# Altium schematic sheet BK1096_Connector.SchDoc: =project_title
size Tabloid; CompanyName: Luxonis Holding; Organization: Luxonis Holding; Address1: 1925 Harmony Park Drive; Address2: Westminster, CO; Address3: 80234; Address4: United States; SheetNumber: 2; SheetTotal: 5
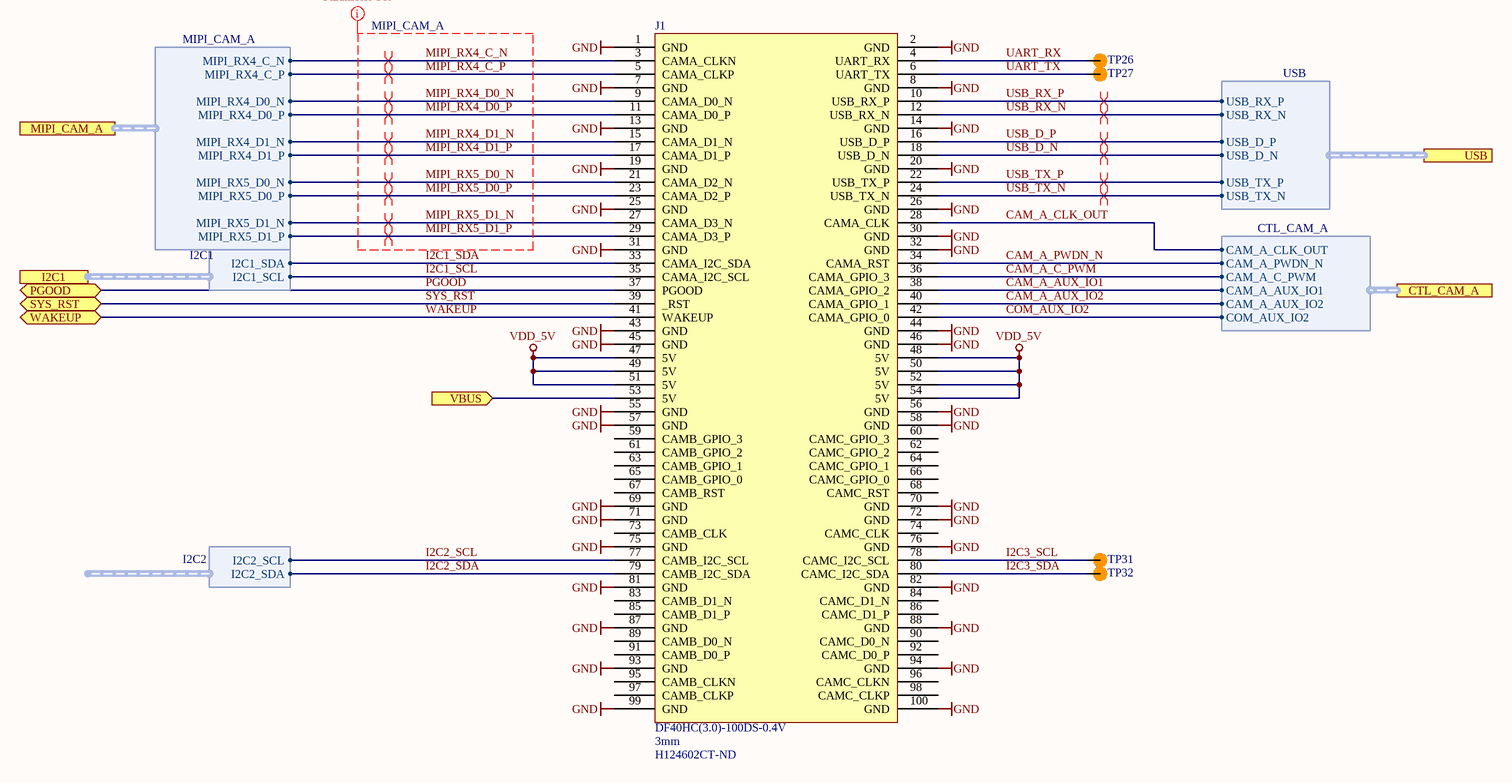
[diagram p0: BK1096_Connector.SchDoc]

## Parts
J1  DF40HC(3.0)-100DS-0.4V  Mated Stacking Heights: 3mm  Supplier Part Number 1: H124602CT-ND  [DF40HC-3.0-100DS-0.4V]
TP26  TP_SMD  [TP_0.75MM_SMD_NO-SILK]  (value not drawn)  (no BOM)
TP27  TP_SMD  [TP_0.75MM_SMD_NO-SILK]  (value not drawn)  (no BOM)
TP31  TP_SMD  [TP_0.75MM_SMD_NO-SILK]  (value not drawn)  (no BOM)
TP32  TP_SMD  [TP_0.75MM_SMD_NO-SILK]  (value not drawn)  (no BOM)

## Ports
CTL_CAM_A (harness CTL_CAM_A), I2C1 (harness I2C1), MIPI_CAM_A (harness MIPI_CAM_A), PGOOD (bidir), SYS_RST (bidir), USB (harness USB), VBUS (in), WAKEUP (bidir)

## Harnesses
MIPI_CAM_A: MIPI_RX4_C_P, MIPI_RX4_C_N, MIPI_RX4_D0_P, MIPI_RX4_D0_N, MIPI_RX4_D1_P, MIPI_RX4_D1_N, MIPI_RX5_D0_P, MIPI_RX5_D0_N, MIPI_RX5_D1_P, MIPI_RX5_D1_N
I2C2: I2C2_SDA, I2C2_SCL
I2C1: I2C1_SDA, I2C1_SCL
USB: USB_D_P, USB_D_N, USB_TX_N, USB_TX_P, USB_RX_N, USB_RX_P
CTL_CAM_A: CAM_A_C_PWM, CAM_A_AUX_IO1, CAM_A_AUX_IO2, COM_AUX_IO2, CAM_A_PWDN_N, CAM_A_CLK_OUT

## Nets
GND: J1.1(GND) J1.2(GND) J1.7(GND) J1.8(GND) J1.13(GND) J1.14(GND) J1.19(GND) J1.20(GND) J1.25(GND) J1.26(GND) J1.30(GND) J1.31(GND) J1.32(GND) J1.43(GND) J1.44(GND) J1.45(GND) J1.46(GND) J1.55(GND) J1.56(GND) J1.57(GND) J1.58(GND) J1.69(GND) J1.70(GND) J1.71(GND) J1.72(GND) J1.75(GND) J1.76(GND) J1.81(GND) J1.82(GND) J1.87(GND) J1.88(GND) J1.93(GND) J1.94(GND) J1.99(GND) J1.100(GND)
VDD_5V: J1.47(5V) J1.48(5V) J1.49(5V) J1.50(5V) J1.51(5V) J1.52(5V) J1.54(5V)
CAM_A_AUX_IO1: J1.38(CAMA_GPIO_2) ; port CTL_CAM_A.CAM_A_AUX_IO1
CAM_A_AUX_IO2: J1.40(CAMA_GPIO_1) ; port CTL_CAM_A.CAM_A_AUX_IO2
CAM_A_C_PWM: J1.36(CAMA_GPIO_3) ; port CTL_CAM_A.CAM_A_C_PWM
CAM_A_CLK_OUT: J1.28(CAMA_CLK) ; port CTL_CAM_A.CAM_A_CLK_OUT
CAM_A_PWDN_N: J1.34(CAMA_RST) ; port CTL_CAM_A.CAM_A_PWDN_N
COM_AUX_IO2: J1.42(CAMA_GPIO_0) ; port CTL_CAM_A.COM_AUX_IO2
I2C1_SCL: J1.35(CAMA_I2C_SCL) ; port I2C1.I2C1_SCL
I2C1_SDA: J1.33(CAMA_I2C_SDA) ; port I2C1.I2C1_SDA
I2C2_SCL: J1.77(CAMB_I2C_SCL) ; harness I2C2.I2C2_SCL
I2C2_SDA: J1.79(CAMB_I2C_SDA) ; harness I2C2.I2C2_SDA
I2C3_SCL: J1.78(CAMC_I2C_SCL) TP31.1
I2C3_SDA: J1.80(CAMC_I2C_SDA) TP32.1
MIPI_RX4_C_N: J1.3(CAMA_CLKN) ; port MIPI_CAM_A.MIPI_RX4_C_N
MIPI_RX4_C_P: J1.5(CAMA_CLKP) ; port MIPI_CAM_A.MIPI_RX4_C_P
MIPI_RX4_D0_N: J1.9(CAMA_D0_N) ; port MIPI_CAM_A.MIPI_RX4_D0_N
MIPI_RX4_D0_P: J1.11(CAMA_D0_P) ; port MIPI_CAM_A.MIPI_RX4_D0_P
MIPI_RX4_D1_N: J1.15(CAMA_D1_N) ; port MIPI_CAM_A.MIPI_RX4_D1_N
MIPI_RX4_D1_P: J1.17(CAMA_D1_P) ; port MIPI_CAM_A.MIPI_RX4_D1_P
MIPI_RX5_D0_N: J1.21(CAMA_D2_N) ; port MIPI_CAM_A.MIPI_RX5_D0_N
MIPI_RX5_D0_P: J1.23(CAMA_D2_P) ; port MIPI_CAM_A.MIPI_RX5_D0_P
MIPI_RX5_D1_N: J1.27(CAMA_D3_N) ; port MIPI_CAM_A.MIPI_RX5_D1_N
MIPI_RX5_D1_P: J1.29(CAMA_D3_P) ; port MIPI_CAM_A.MIPI_RX5_D1_P
PGOOD: J1.37(PGOOD) ; port PGOOD
SYS_RST: J1.39(_RST) ; port SYS_RST
UART_RX: J1.4(UART_RX) TP26.1
UART_TX: J1.6(UART_TX) TP27.1
USB_D_N: J1.18(USB_D_N) ; port USB.USB_D_N
USB_D_P: J1.16(USB_D_P) ; port USB.USB_D_P
USB_RX_N: J1.12(USB_RX_N) ; port USB.USB_RX_N
USB_RX_P: J1.10(USB_RX_P) ; port USB.USB_RX_P
USB_TX_N: J1.24(USB_TX_N) ; port USB.USB_TX_N
USB_TX_P: J1.22(USB_TX_P) ; port USB.USB_TX_P
VBUS: J1.53(5V) ; port VBUS
WAKEUP: J1.41(WAKEUP) ; port WAKEUP

Not connected (* = marked no-connect by the designer): J1 59(CAMB_GPIO_3) 60(CAMC_GPIO_3) 61(CAMB_GPIO_2) 62(CAMC_GPIO_2) 63(CAMB_GPIO_1) 64(CAMC_GPIO_1) 65(CAMB_GPIO_0) 66(CAMC_GPIO_0) 67(CAMB_RST) 68(CAMC_RST) 73(CAMB_CLK) 74(CAMC_CLK) 83(CAMB_D1_N) 84(CAMC_D1_N) 85(CAMB_D1_P) 86(CAMC_D1_P) 89(CAMB_D0_N) 90(CAMC_D0_N) 91(CAMB_D0_P) 92(CAMC_D0_P) 95(CAMB_CLKN) 96(CAMC_CLKN) 97(CAMB_CLKP) 98(CAMC_CLKP)

## Layout directives
differential pair; differential pair class USB_D: USB_D_N, USB_D_P
differential pair; differential pair class USB_RxTX: USB_RX_N, USB_RX_P, USB_TX_N, USB_TX_P
differential pair; differential pair class MIPI_CAMS: MIPI_RX4_C_N, MIPI_RX4_C_P, MIPI_RX4_D0_N, MIPI_RX4_D0_P, MIPI_RX4_D1_N, MIPI_RX4_D1_P, MIPI_RX5_D0_N, MIPI_RX5_D0_P, MIPI_RX5_D1_N, MIPI_RX5_D1_P
net class MIPI_CAM_A; rule Matched Net Lengths [Tolerance = 5mil]: MIPI_RX4_C_N, MIPI_RX4_C_P, MIPI_RX4_D0_N, MIPI_RX4_D0_P, MIPI_RX4_D1_N, MIPI_RX4_D1_P, MIPI_RX5_D0_N, MIPI_RX5_D0_P, MIPI_RX5_D1_N, MIPI_RX5_D1_P

## Notes on the sheet
- Title
- Size:
- Date:
- Tabloid
- Number:
- Time:
- Revision:
- Sheet
- of
- Drawn by:

## Library data of the parts
J1 = DF40HC(3.0)-100DS-0.4V: CONN RCPT 100POS 0.4MM SMD GOLD; Manufacturer 1: Hirose; Manufacturer Part Number 1: DF40HC(3.0)-100DS-0.4V(58; Connector Type: Receptacle; Number of Positions: 100; Pitch: 0.016inch; Supplier 1: Digi-Key; Stock 1: 867; Pricing 1: 1=2.75000, 10=2.64000, 25=2.42000, 50=2.31000, 100=2.20000, 250=1.92500, 500=1.87000 (USD); RoHS: Yes; Mount: Surface Mount; Contact Plating: Gold; Packaging: Tape and Reel; Number of Rows: 2; Package Quantity: 1000; Lead Free: Lead Free; ComponentLink1URL: https://datasheet.ciiva.com/46636/ed-df40-20140305-46636517.pdf?src-supplier=Digi-Key; ComponentLink1Description: https://datasheet.ciiva.com/46636/ed-df40-20140305-46636517.pdf?src-supplier=Digi-Key; ComponentLink2URL: https://datasheet.ciiva.com/18562/ed-df40-20140305-18562189.pdf?src-supplier=Digi-Key; ComponentLink2Description: https://datasheet.ciiva.com/18562/ed-df40-20140305-18562189.pdf?src-supplier=Digi-Key
TP26 TP27 TP31 TP32 = TP_SMD: circular pad test point, SMD